# Altium schematic sheet TPA6133A2.SchDoc
size A4
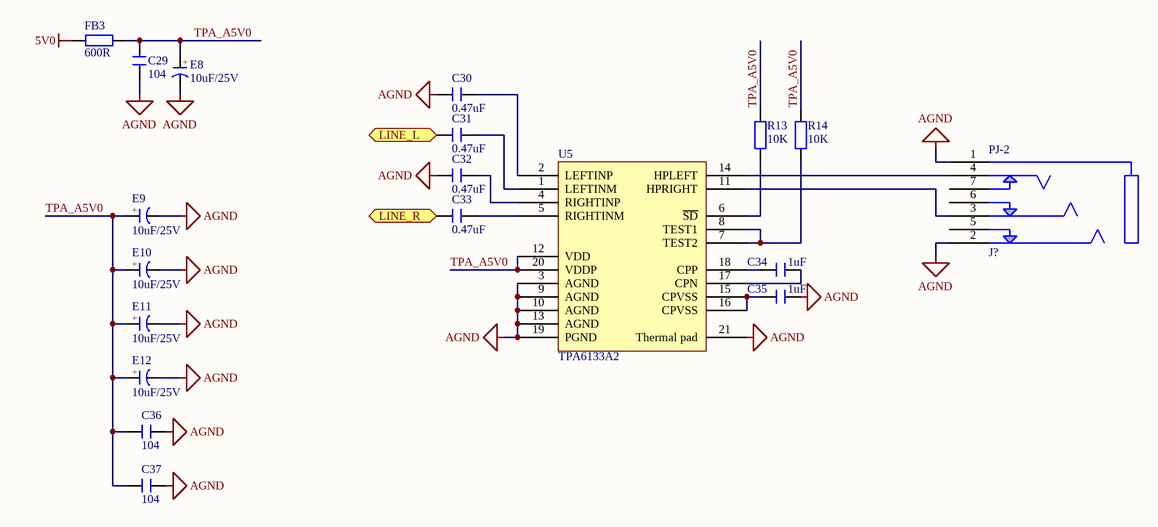
[diagram p0: TPA6133A2.SchDoc]

## Parts
C29  104  [C 0603_L]
C30  0.47uF  [WIMA 0.47uF]
C31  0.47uF  [WIMA 0.47uF]
C32  0.47uF  [WIMA 0.47uF]
C33  0.47uF  [WIMA 0.47uF]
C34  1uF  [C 0603_L]
C35  1uF  [C 0603_L]
C36  104  [C 0603_L]
C37  104  [C 0603_L]
E8  10uF/25V  [CD A(3216)]
E9  10uF/25V  [CD A(3216)]
E10  10uF/25V  [CD A(3216)]
E11  10uF/25V  [CD A(3216)]
E12  10uF/25V  [CD A(3216)]
FB3  600R  [R 0805_L]
PJ-2  J?  [PJ-393-7A]
R13  10K  [R 0603_L]
R14  10K  [R 0603_L]
U5  TPA6133A2  [QFN20 4x4_N]

## Ports
LINE_L (in), LINE_R (in)

## Nets
5V0: FB3.1
AGND: C29.1 C30.1 C32.1 C35.2 C36.1 C37.1 E8.2(K) E9.2(K) E10.2(K) E11.2(K) E12.2(K) PJ-2.1 PJ-2.2 U5.3(AGND) U5.9(AGND) U5.10(AGND) U5.13(AGND) U5.19(PGND) U5.21(Thermal_pad)
LINE_L: C31.1 ; port LINE_L
LINE_R: C33.1 ; port LINE_R
TPA_A5V0: C29.2 C36.2 C37.2 E8.1(A) E9.1(A) E10.1(A) E11.1(A) E12.1(A) FB3.2 R13.1 R14.1 U5.12(VDD) U5.20(VDDP)
NetC30_2: C30.2 U5.2(LEFTINP)
NetC31_2: C31.2 U5.1(LEFTINM)
NetC32_2: C32.2 U5.4(RIGHTINP)
NetC33_2: C33.2 U5.5(RIGHTINM)
NetC34_1: C34.1 U5.18(CPP)
NetC34_2: C34.2 U5.17(CPN)
NetC35_1: C35.1 U5.15(CPVSS) U5.16(CPVSS)
NetPJ-2_3: PJ-2.3 U5.11(HPRIGHT)
NetPJ-2_4: PJ-2.4 U5.14(HPLEFT)
NetR13_2: R13.2 U5.6(~{SD})
NetR14_2: R14.2 U5.7(TEST2) U5.8(TEST1)

Not connected (* = marked no-connect by the designer): PJ-2 5 6 7

## Notes on the sheet
- (in symbol CT) +

## Library data of the parts
C29-C37 = C: 贴片电容; BOM名称: 无极性贴片电容; 优秀评价可免费更新: 联系淘宝ID：黄晶宝石，获取更新版封装库; 卖家免费技术支持，联系售后: 唯一出售店铺网址https://shop463601444.taobao.com; 本封装库来自淘宝卖家 ID：黄晶宝石: 其他店铺购入均为盗版，请立即申请退款
E8-E12 = CT: 贴片钽电容; 优秀评价可免费更新: 联系淘宝ID：黄晶宝石，获取更新版封装库; 卖家免费技术支持，联系售后: 唯一出售店铺网址https://shop463601444.taobao.com; 本封装库来自淘宝卖家 ID：黄晶宝石: 其他店铺购入均为盗版，请立即申请退款; BOM名称: 贴片钽电容
FB3 R13 R14 = R: 贴片电阻; 优秀评价可免费更新: 联系淘宝ID：黄晶宝石，获取更新版封装库; 卖家免费技术支持，联系售后: 唯一出售店铺网址https://shop463601444.taobao.com; 本封装库来自淘宝卖家 ID：黄晶宝石: 其他店铺购入均为盗版，请立即申请退款; BOM名称: 贴片电阻
PJ-2 = PJ-393-7: 3.5mm 4段 耳机插座